# Altium schematic sheet MCU.SchDoc
size A; SheetNumber: 3; SheetTotal: 3
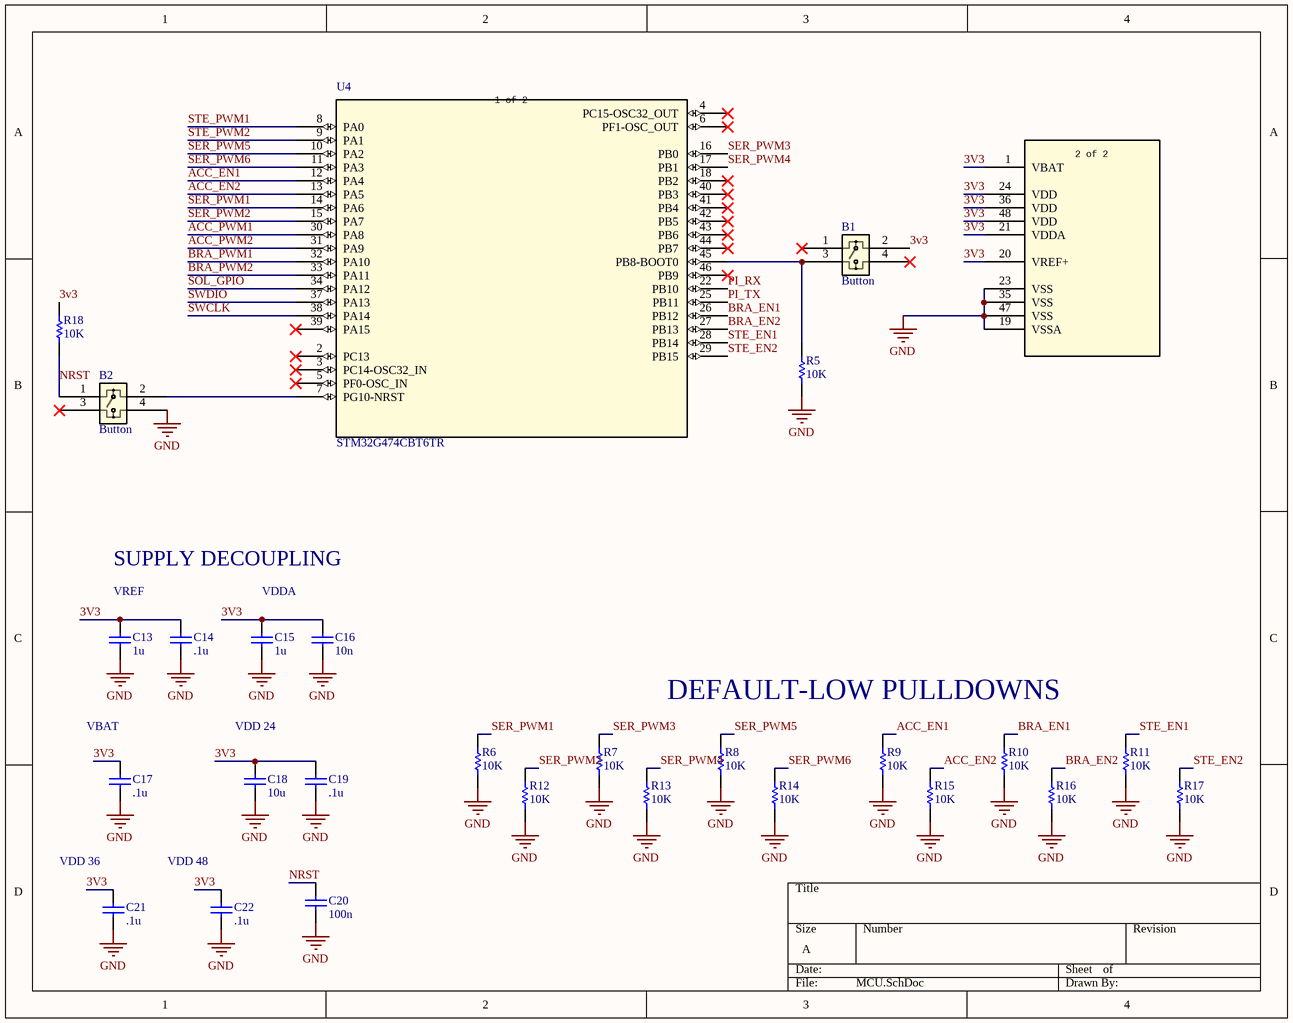
[diagram p0: MCU.SchDoc]

## Parts
B1  Button  [Button]
B2  Button  [Button]
C13  value 1u  [1U]  (hidden comment: Capacitor)
C14  value .1u  [1U]  (hidden comment: Capacitor)
C15  value 1u  [1U]  (hidden comment: Capacitor)
C16  value 10n  [1U]  (hidden comment: Capacitor)
C17  value .1u  [1U]  (hidden comment: Capacitor)
C18  value 10u  [1U]  (hidden comment: Capacitor)
C19  value .1u  [1U]  (hidden comment: Capacitor)
C20  value 100n  [1U]  (hidden comment: Capacitor)
C21  value .1u  [1U]  (hidden comment: Capacitor)
C22  value .1u  [1U]  (hidden comment: Capacitor)
R5  value 10K  [resistor]  (hidden comment: Resistor)
R6  value 10K  [resistor]  (hidden comment: Resistor)
R7  value 10K  [resistor]  (hidden comment: Resistor)
R8  value 10K  [resistor]  (hidden comment: Resistor)
R9  value 10K  [resistor]  (hidden comment: Resistor)
R10  value 10K  [resistor]  (hidden comment: Resistor)
R11  value 10K  [resistor]  (hidden comment: Resistor)
R12  value 10K  [resistor]  (hidden comment: Resistor)
R13  value 10K  [resistor]  (hidden comment: Resistor)
R14  value 10K  [resistor]  (hidden comment: Resistor)
R15  value 10K  [resistor]  (hidden comment: Resistor)
R16  value 10K  [resistor]  (hidden comment: Resistor)
R17  value 10K  [resistor]  (hidden comment: Resistor)
R18  value 10K  [resistor]  (hidden comment: Resistor)
U4  STM32G474CBT6TR  [STM32G474CBT6TR]

## Nets
GND: B2.4 C13.2 C14.2 C15.2 C16.2 C17.2 C18.2 C19.2 C20.2 C21.2 C22.2 R5.1 R6.1 R7.1 R8.1 R9.1 R10.1 R11.1 R12.1 R13.1 R14.1 R15.1 R16.1 R17.1 U4.19(VSSA) U4.23(VSS) U4.35(VSS) U4.47(VSS)
3V3: B1.2 C13.1 C14.1 C15.1 C16.1 C17.1 C18.1 C19.1 C21.1 C22.1 R18.2 U4.1(VBAT) U4.20(VREF+) U4.21(VDDA) U4.24(VDD) U4.36(VDD) U4.48(VDD)
ACC_EN1: R9.2 U4.12(PA4)
ACC_EN2: R15.2 U4.13(PA5)
ACC_PWM1: U4.30(PA8)
ACC_PWM2: U4.31(PA9)
BRA_EN1: R10.2 U4.26(PB12)
BRA_EN2: R16.2 U4.27(PB13)
BRA_PWM1: U4.32(PA10)
BRA_PWM2: U4.33(PA11)
NRST: B2.1 C20.1 R18.1
PI_RX: U4.22(PB10)
PI_TX: U4.25(PB11)
SER_PWM1: R6.2 U4.14(PA6)
SER_PWM2: R12.2 U4.15(PA7)
SER_PWM3: R7.2 U4.16(PB0)
SER_PWM4: R13.2 U4.17(PB1)
SER_PWM5: R8.2 U4.10(PA2)
SER_PWM6: R14.2 U4.11(PA3)
SOL_GPIO: U4.34(PA12)
STE_EN1: R11.2 U4.28(PB14)
STE_EN2: R17.2 U4.29(PB15)
STE_PWM1: U4.8(PA0)
STE_PWM2: U4.9(PA1)
SWCLK: U4.38(PA14)
SWDIO: U4.37(PA13)
NetB1_3: B1.3 R5.2 U4.45(PB8-BOOT0)
NetB2_2: B2.2 U4.7(PG10-NRST)

Not connected (* = marked no-connect by the designer): B1 1* 4*; B2 3*; U4 2(PC13)* 3(PC14-OSC32_IN)* 4(PC15-OSC32_OUT)* 5(PF0-OSC_IN)* 6(PF1-OSC_OUT)* 18(PB2)* 39(PA15)* 40(PB3)* 41(PB4)* 42(PB5)* 43(PB6)* 44(PB7)* 46(PB9)*

## Notes on the sheet
- SUPPLY DECOUPLING
- (near C13) VREF
- VDDA
- DEFAULT-LOW PULLDOWNS
- (near C17) VBAT
- VDD 24
- (near C21) VDD 36
- (near C22) VDD 48
- (in symbol STM32G474CBT6TR) 1 of 2; 2 of 2

## Library data of the parts
C13 = Capacitor: U4 VREF decoupling 2; SimulationGenericComponent: True
C14 = Capacitor: U4 VREF decoupling 1; SimulationGenericComponent: True
C15 = Capacitor: U4 VDDA decoupling 2; SimulationGenericComponent: True
C16 = Capacitor: U4 VDDA decoupling 1; SimulationGenericComponent: True
C17 = Capacitor: U4 VBAT decoupling; SimulationGenericComponent: True
C18 = Capacitor: Local 3.3 V bulk capacitor; SimulationGenericComponent: True
C19 = Capacitor: U4 VDD pin 24 decoupling; SimulationGenericComponent: True
C20 = Capacitor: SimulationGenericComponent: True
C21 = Capacitor: U4 VDD pin 36 decoupling; SimulationGenericComponent: True
C22 = Capacitor: U4 VDD pin 48 decoupling; SimulationGenericComponent: True
R5-R18 = Resistor: TC1: 0; SimulationGenericComponent: True; TC2: 0